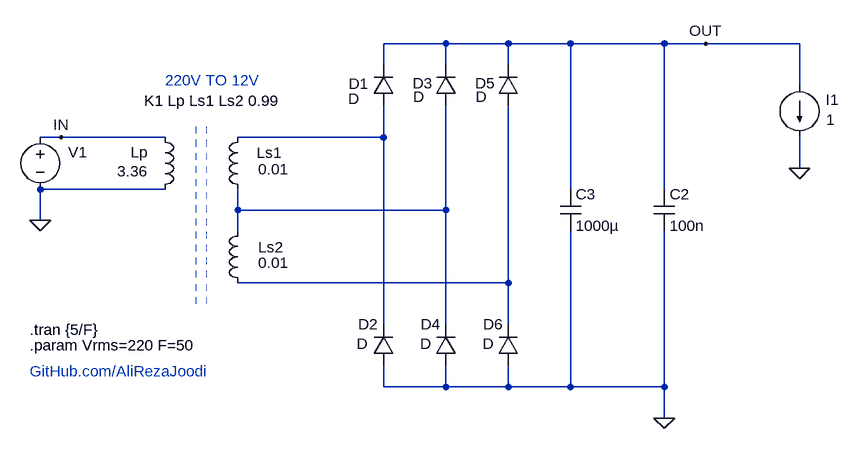
[diagram p0: schematic v1.0.asc]
v1.0.asc, the LTspice schematic file:
Version 4.1
SHEET 1 1736 680
WIRE 416 16 320 16
WIRE 512 16 416 16
WIRE 608 16 512 16
WIRE 752 16 608 16
WIRE 816 16 752 16
WIRE 960 16 816 16
WIRE 320 48 320 16
WIRE 416 48 416 16
WIRE 512 48 512 16
WIRE 960 80 960 16
WIRE -176 160 -208 160
WIRE -16 160 -176 160
WIRE 320 160 320 112
WIRE 320 160 96 160
WIRE 960 208 960 160
WIRE -16 240 -208 240
WIRE 608 240 608 16
WIRE 752 240 752 16
WIRE 96 272 96 240
WIRE 416 272 416 112
WIRE 416 272 96 272
WIRE -208 288 -208 240
WIRE 96 304 96 272
WIRE 512 384 512 112
WIRE 512 384 96 384
WIRE 320 448 320 160
WIRE 416 448 416 272
WIRE 512 448 512 384
WIRE 320 544 320 512
WIRE 416 544 416 512
WIRE 416 544 320 544
WIRE 512 544 512 512
WIRE 512 544 416 544
WIRE 608 544 608 304
WIRE 608 544 512 544
WIRE 752 544 752 304
WIRE 752 544 608 544
WIRE 752 592 752 544
FLAG 816 16 OUT
FLAG 752 592 0
FLAG 960 208 0
FLAG -208 288 0
FLAG -176 160 IN
SYMBOL voltage -208 144 R0
WINDOW 0 43 39 Left 2
WINDOW 3 -248 72 Invisible 2
WINDOW 123 0 0 Left 0
WINDOW 39 -162 108 Left 2
SYMATTR InstName V1
SYMATTR Value SINE(0 {Vrms*1.414} {F})
SYMBOL diode 336 112 R180
WINDOW 0 39 34 Left 2
WINDOW 3 53 11 Left 2
SYMATTR InstName D1
SYMBOL diode 336 512 R180
WINDOW 0 24 64 Left 2
WINDOW 3 40 34 Left 2
SYMATTR InstName D2
SYMBOL diode 432 112 R180
WINDOW 0 36 35 Left 2
WINDOW 3 49 14 Left 2
SYMATTR InstName D3
SYMBOL diode 432 512 R180
WINDOW 0 24 64 Left 2
WINDOW 3 38 34 Left 2
SYMATTR InstName D4
SYMBOL cap 736 240 R0
SYMATTR InstName C2
SYMATTR Value 100n
SYMBOL cap 592 240 R0
SYMATTR InstName C3
SYMATTR Value 1000µ
SYMBOL ind -32 256 M180
WINDOW 0 -37 73 Left 2
WINDOW 3 -58 44 Left 2
SYMATTR InstName Lp
SYMATTR Value 3.36
SYMATTR Type ind
SYMATTR SpiceLine Ipk=0.2 Rser=82 Rpar=48k
SYMBOL ind 112 256 R180
WINDOW 0 -52 72 Left 2
WINDOW 3 -15 47 Right 2
SYMATTR InstName Ls1
SYMATTR Value 0.01
SYMATTR Type ind
SYMATTR SpiceLine Ipk=3 Rser=0.6
SYMBOL ind 112 400 R180
WINDOW 0 -54 71 Left 2
WINDOW 3 -15 47 Right 2
SYMATTR InstName Ls2
SYMATTR Value 0.01
SYMATTR Type ind
SYMATTR SpiceLine Ipk=3 Rser=0.6
SYMBOL diode 528 112 R180
WINDOW 0 36 35 Left 2
WINDOW 3 49 14 Left 2
SYMATTR InstName D5
SYMBOL diode 528 512 R180
WINDOW 0 24 64 Left 2
WINDOW 3 38 34 Left 2
SYMATTR InstName D6
SYMBOL current 960 80 R0
WINDOW 0 40 22 Left 2
WINDOW 3 41 53 Left 2
WINDOW 123 0 0 Left 0
WINDOW 39 0 0 Left 0
SYMATTR InstName I1
SYMATTR Value 1
TEXT -224 456 Left 2 !.tran {5/F}
TEXT -48 104 Left 2 !K1 Lp Ls1 Ls2 0.99
TEXT -16 72 Left 2 ;220V TO 12V
TEXT -224 480 Left 2 !.param Vrms=220 F=50
TEXT -224 520 Left 2 ;GitHub.com/AliRezaJoodi
LINE Normal 32 416 32 144 2
LINE Normal 32 416 32 144 2
LINE Normal 48 416 48 144 2

The netlist it stands for:
* v1.0.asc
V1 IN 0 SINE(0 {Vrms*1.414} {F})
D1 N001 OUT D
D2 0 N001 D
D3 N002 OUT D
D4 0 N002 D
C2 OUT 0 100n
C3 OUT 0 1000µ
Lp 0 IN 3.36 Ipk=0.2 Rser=82 Rpar=48k
Ls1 N002 N001 0.01 Ipk=3 Rser=0.6
Ls2 N003 N002 0.01 Ipk=3 Rser=0.6
D5 N003 OUT D
D6 0 N003 D
I1 OUT 0 1
.model D D
.lib standard.dio
.tran {5/F}
K1 Lp Ls1 Ls2 0.99
* 220V TO 12V
.param Vrms=220 F=50
* GitHub.com/AliRezaJoodi
.backanno
.end